# EAGLE schematic ledclock (EAGLE 7.3.0)
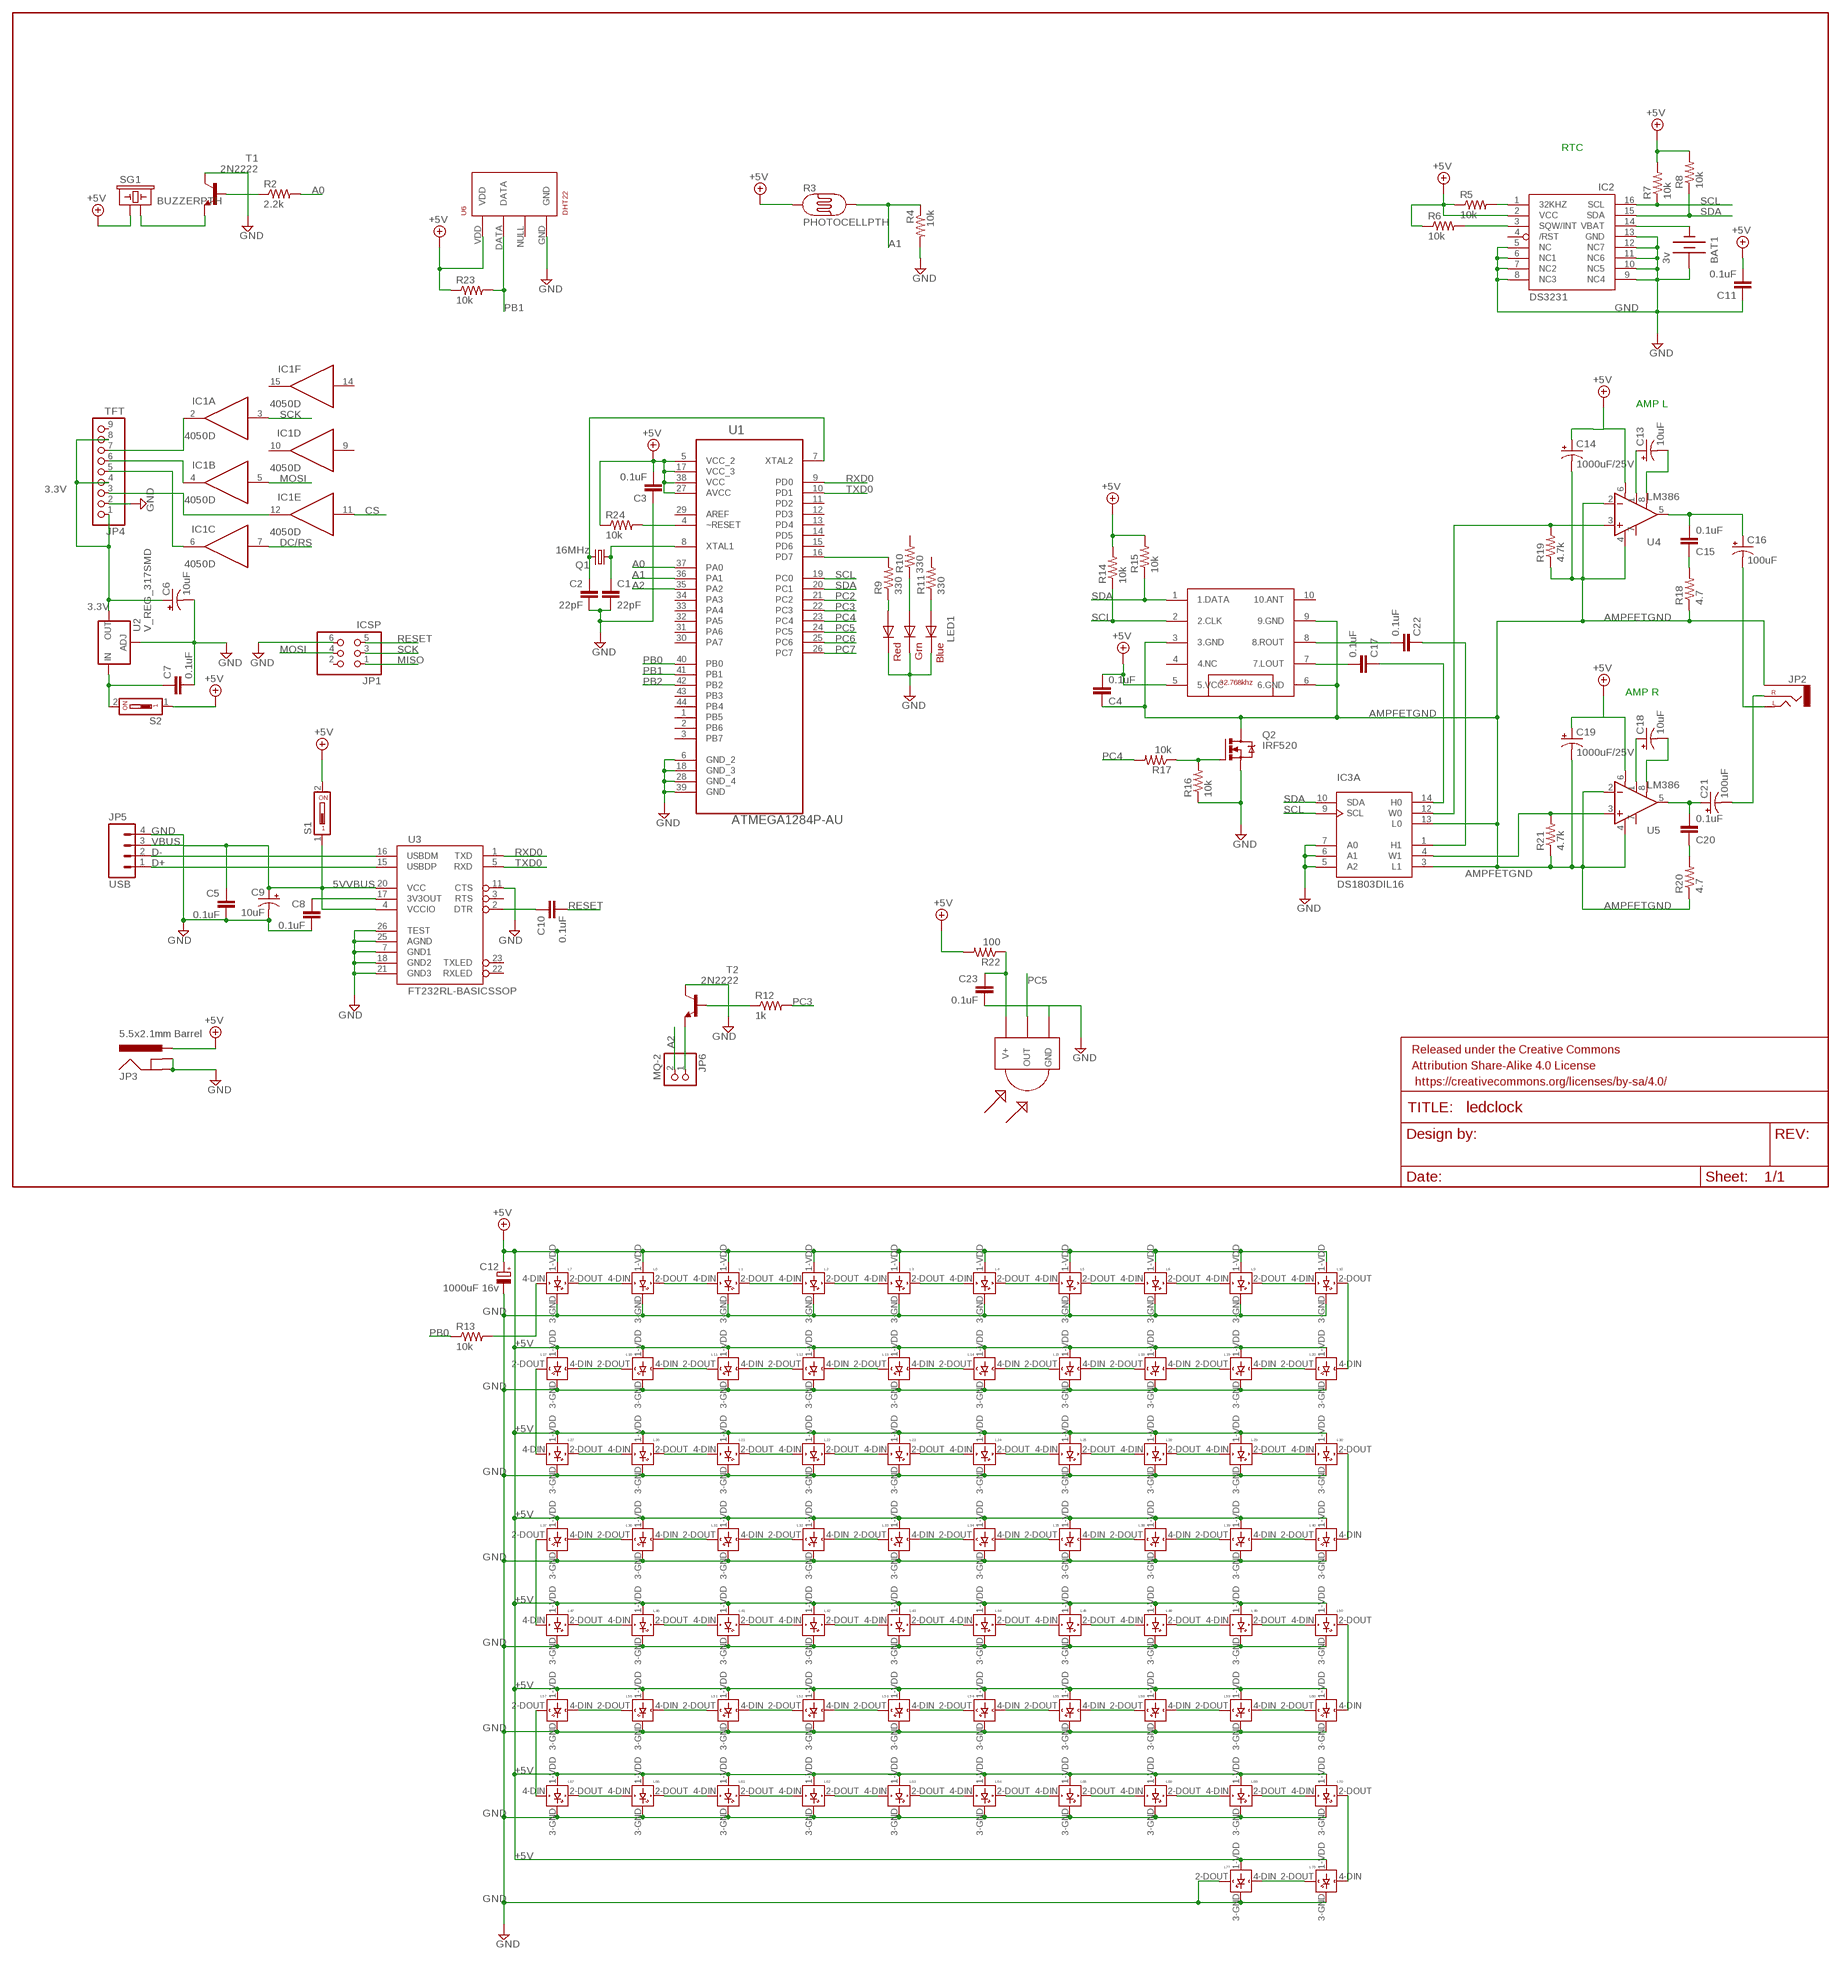
[diagram p0: schematic, sheet 1]

## Parts
BAT1  3v  BATTERY12MM  [BATTCON_12MM]
C1  22pF  22PF-50V-5%(0603)  [0603-CAP]
C2  22pF  22PF-50V-5%(0603)  [0603-CAP]
C3  0.1uF  0.1UF-16V(+-10%)(0402)  [0402-CAP]
C4  0.1uF  0.1UF-25V(+80/-20%)(0603)  [0603-CAP]
C5  0.1uF  0.1UF-25V(+80/-20%)(0603)  [0603-CAP]
C6  10uF  CAP_POL1206-KIT  [EIA3216-KIT]
C7  0.1uF  0.1UF-25V(+80/-20%)(0603)  [0603-CAP]
C8  0.1uF  0.1UF-25V(+80/-20%)(0603)  [0603-CAP]
C9  10uF  CAP_POLPTH2  [CPOL-RADIAL-10UF-25V]
C10  0.1uF  0.1UF-25V(+80/-20%)(0603)  [0603-CAP]
C11  0.1uF  0.1UF-25V(+80/-20%)(0603)  [0603-CAP]
C12  1000uF 16v  CPOL-EUE10-20  [EB20D]
C13  10uF  CAP_POL1206-KIT  [EIA3216-KIT]
C14  1000uF/25V  CAP_POLPTH4  [CPOL-RADIAL-1000UF-25V]
C15  0.1uF  0.1UF-25V(+80/-20%)(0603)  [0603-CAP]
C16  100uF  100UF-63V-20%(ELECT)  [NIC_10X10.5_CAP]
C17  0.1uF  0.1UF-25V(+80/-20%)(0603)  [0603-CAP]
C18  10uF  CAP_POL1206-KIT  [EIA3216-KIT]
C19  1000uF/25V  CAP_POLPTH4  [CPOL-RADIAL-1000UF-25V]
C20  0.1uF  0.1UF-25V(+80/-20%)(0603)  [0603-CAP]
C21  100uF  100UF-63V-20%(ELECT)  [NIC_10X10.5_CAP]
C22  0.1uF  0.1UF-25V(+80/-20%)(0603)  [0603-CAP]
C23  0.1uF  0.1UF-25V(+80/-20%)(0603)  [0603-CAP]
FRAME1  FRAME-LEDGER  [CREATIVE_COMMONS]
IC1  4050D  [SO16]
IC2  DS3231/SO  [SO16W]
IC3  DS1803DIL16  [DIL16]
JP1  ICSP  PINHD-2X3/90  [2X03/90]
JP2  AUDIO-JACK1:1  [STEREOJACK2.5MM]
JP3  5.5x2.1mm Barrel  POWER_JACKSMD  [POWER_JACK_SMD]
JP4  TFT  PINHD-1X9/90  [1X09/90]
JP5  USB  M04JST  [1X04-1.5MM_JST]
JP6  MQ-2  PINHD-1X2/90  [1X02/90]
L1  WS2812B  [WS2812B]
L2  WS2812B  [WS2812B]
L3  WS2812B  [WS2812B]
L4  WS2812B  [WS2812B]
L5  WS2812B  [WS2812B]
L6  WS2812B  [WS2812B]
L7  WS2812B  [WS2812B]
L8  WS2812B  [WS2812B]
L9  WS2812B  [WS2812B]
L10  WS2812B  [WS2812B]
L11  WS2812B  [WS2812B]
L12  WS2812B  [WS2812B]
L13  WS2812B  [WS2812B]
L14  WS2812B  [WS2812B]
L15  WS2812B  [WS2812B]
L16  WS2812B  [WS2812B]
L17  WS2812B  [WS2812B]
L18  WS2812B  [WS2812B]
L19  WS2812B  [WS2812B]
L20  WS2812B  [WS2812B]
L21  WS2812B  [WS2812B]
L22  WS2812B  [WS2812B]
L23  WS2812B  [WS2812B]
L24  WS2812B  [WS2812B]
L25  WS2812B  [WS2812B]
L26  WS2812B  [WS2812B]
L27  WS2812B  [WS2812B]
L28  WS2812B  [WS2812B]
L29  WS2812B  [WS2812B]
L30  WS2812B  [WS2812B]
L31  WS2812B  [WS2812B]
L32  WS2812B  [WS2812B]
L33  WS2812B  [WS2812B]
L34  WS2812B  [WS2812B]
L35  WS2812B  [WS2812B]
L36  WS2812B  [WS2812B]
L37  WS2812B  [WS2812B]
L38  WS2812B  [WS2812B]
L39  WS2812B  [WS2812B]
L40  WS2812B  [WS2812B]
L41  WS2812B  [WS2812B]
L42  WS2812B  [WS2812B]
L43  WS2812B  [WS2812B]
L44  WS2812B  [WS2812B]
L45  WS2812B  [WS2812B]
L46  WS2812B  [WS2812B]
L47  WS2812B  [WS2812B]
L48  WS2812B  [WS2812B]
L49  WS2812B  [WS2812B]
L50  WS2812B  [WS2812B]
L51  WS2812B  [WS2812B]
L52  WS2812B  [WS2812B]
L53  WS2812B  [WS2812B]
L54  WS2812B  [WS2812B]
L55  WS2812B  [WS2812B]
L56  WS2812B  [WS2812B]
L57  WS2812B  [WS2812B]
L58  WS2812B  [WS2812B]
L59  WS2812B  [WS2812B]
L60  WS2812B  [WS2812B]
L61  WS2812B  [WS2812B]
L62  WS2812B  [WS2812B]
L63  WS2812B  [WS2812B]
L64  WS2812B  [WS2812B]
L65  WS2812B  [WS2812B]
L66  WS2812B  [WS2812B]
L67  WS2812B  [WS2812B]
L68  WS2812B  [WS2812B]
L69  WS2812B  [WS2812B]
L70  WS2812B  [WS2812B]
L76  WS2812B  [WS2812B]
L77  WS2812B  [WS2812B]
LED1  RGBLED5050  [RGBLED5050]
Q1  16MHz  CRYSTALHC49S  [HC49/S]
Q2  IRF520  [TO220BV]
R2  2.2k  RESISTOR1206  [1206]
R3  PHOTOCELLPTH  [PHOTOCELL]
R4  10k  RESISTOR1206  [1206]
R5  10k  RESISTOR1206  [1206]
R6  10k  RESISTOR1206  [1206]
R7  10k  RESISTOR1206  [1206]
R8  10k  RESISTOR1206  [1206]
R9  330  RESISTOR1206  [1206]
R10  330  RESISTOR1206  [1206]
R11  330  RESISTOR1206  [1206]
R12  1k  RESISTOR1206  [1206]
R13  10k  RESISTOR1206  [1206]
R14  10k  RESISTOR1206  [1206]
R15  10k  RESISTOR1206  [1206]
R16  10k  RESISTOR1206  [1206]
R17  10k  RESISTOR1206  [1206]
R18  4.7  RESISTOR1206  [1206]
R19  4.7k  RESISTOR1206  [1206]
R20  4.7  RESISTOR1206  [1206]
R21  4.7k  RESISTOR1206  [1206]
R22  100  RESISTOR1206  [1206]
R23  10k  RESISTOR1206  [1206]
R24  10k  RESISTOR1206  [1206]
S1  DS01  [DS-01]
S2  DS01  [DS-01]
SG1  BUZZERPTH  [BUZZER-12MM]
T1  2N2222  [TO18]
T2  2N2222  [TO18]
U1  ATMEGA1284P-AU  [QFP80P1200X1200X120-44N]
U2  V_REG_317SMD  [SOT223]
U3  FT232RL-BASICSSOP  [SSOP28DB]
U4  LM386  [DIP08]
U5  LM386  [DIP08]
U6  DHT22  RHT03_DHT-22_AM2302  [RHT03_DHT-22]
U$1  TEA5767  [TJ-102BC]
U$2  TSOP4838  [TSOP18XX]

## Nets
3.3V: C6.A(+) JP4.1 JP4.4 JP4.8 U2.2(OUT)
5VVBUS: C5.1 C9.1(+) S1.1 U3.4(VCCIO) U3.20(VCC)
+5V: C3.2 C4.2 C11.2 C12.+ C14.+ C19.+ IC2.2(VCC) JP3.VIN0(PWR) L1.1-VDD(VDD) L2.1-VDD(VDD) L3.1-VDD(VDD) L4.1-VDD(VDD) L5.1-VDD(VDD) L6.1-VDD(VDD) L7.1-VDD(VDD) L8.1-VDD(VDD) L9.1-VDD(VDD) L10.1-VDD(VDD) L11.1-VDD(VDD) L12.1-VDD(VDD) L13.1-VDD(VDD) L14.1-VDD(VDD) L15.1-VDD(VDD) L16.1-VDD(VDD) L17.1-VDD(VDD) L18.1-VDD(VDD) L19.1-VDD(VDD) L20.1-VDD(VDD) L21.1-VDD(VDD) L22.1-VDD(VDD) L23.1-VDD(VDD) L24.1-VDD(VDD) L25.1-VDD(VDD) L26.1-VDD(VDD) L27.1-VDD(VDD) L28.1-VDD(VDD) L29.1-VDD(VDD) L30.1-VDD(VDD) L31.1-VDD(VDD) L32.1-VDD(VDD) L33.1-VDD(VDD) L34.1-VDD(VDD) L35.1-VDD(VDD) L36.1-VDD(VDD) L37.1-VDD(VDD) L38.1-VDD(VDD) L39.1-VDD(VDD) L40.1-VDD(VDD) L41.1-VDD(VDD) L42.1-VDD(VDD) L43.1-VDD(VDD) L44.1-VDD(VDD) L45.1-VDD(VDD) L46.1-VDD(VDD) L47.1-VDD(VDD) L48.1-VDD(VDD) L49.1-VDD(VDD) L50.1-VDD(VDD) L51.1-VDD(VDD) L52.1-VDD(VDD) L53.1-VDD(VDD) L54.1-VDD(VDD) L55.1-VDD(VDD) L56.1-VDD(VDD) L57.1-VDD(VDD) L58.1-VDD(VDD) L59.1-VDD(VDD) L60.1-VDD(VDD) L61.1-VDD(VDD) L62.1-VDD(VDD) L63.1-VDD(VDD) L64.1-VDD(VDD) L65.1-VDD(VDD) L66.1-VDD(VDD) L67.1-VDD(VDD) L68.1-VDD(VDD) L69.1-VDD(VDD) L70.1-VDD(VDD) L76.1-VDD(VDD) L77.1-VDD(VDD) R3.1 R5.1 R6.1 R7.2 R8.2 R14.2 R15.2 R22.2 R23.1 R24.1 S1.2 S2.1 SG1.+ U1.5(VCC_2) U1.17(VCC_3) U1.27(AVCC) U1.38(VCC) U4.6(V+) U5.6(V+) U6.VDD U$1.5(5.VCC)
A0: R2.2 U1.37(PA0)
A1: R3.2 R4.1 U1.36(PA1)
A2: JP6.2 U1.35(PA2)
AMPFETGND: C4.1 C14.- C19.- IC3.3(A:L1) IC3.13(A:L0) JP2.5(SLEEVE) Q2.D R18.1 R19.1 R20.1 R21.1 U4.2(-IN) U4.4(V-) U5.2(-IN) U5.4(V-) U$1.3(3.GND) U$1.6(6.GND) U$1.9(9.GND)
CS: IC1.11(E:I)
D+: JP5.1 U3.15(USBDP)
D-: JP5.2 U3.16(USBDM)
DC/RS: IC1.7(C:I)
GND: BAT1.PWR@1(+) C1.2 C2.2 C3.1 C5.2 C6.C(-) C7.2 C8.2 C9.2(-) C11.1 C12.- C23.2 IC2.5(NC) IC2.6(NC1) IC2.7(NC2) IC2.8(NC3) IC2.13(GND) IC3.5(A:A2) IC3.6(A:A1) IC3.7(A:A0) JP1.6 JP3.GND(GNDBREAK) JP3.P$4(GND) JP4.2 JP5.4 L1.3-GND(GND) L2.3-GND(GND) L3.3-GND(GND) L4.3-GND(GND) L5.3-GND(GND) L6.3-GND(GND) L7.3-GND(GND) L8.3-GND(GND) L9.3-GND(GND) L10.3-GND(GND) L11.3-GND(GND) L12.3-GND(GND) L13.3-GND(GND) L14.3-GND(GND) L15.3-GND(GND) L16.3-GND(GND) L17.3-GND(GND) L18.3-GND(GND) L19.3-GND(GND) L20.3-GND(GND) L21.3-GND(GND) L22.3-GND(GND) L23.3-GND(GND) L24.3-GND(GND) L25.3-GND(GND) L26.3-GND(GND) L27.3-GND(GND) L28.3-GND(GND) L29.3-GND(GND) L30.3-GND(GND) L31.3-GND(GND) L32.3-GND(GND) L33.3-GND(GND) L34.3-GND(GND) L35.3-GND(GND) L36.3-GND(GND) L37.3-GND(GND) L38.3-GND(GND) L39.3-GND(GND) L40.3-GND(GND) L41.3-GND(GND) L42.3-GND(GND) L43.3-GND(GND) L44.3-GND(GND) L45.3-GND(GND) L46.3-GND(GND) L47.3-GND(GND) L48.3-GND(GND) L49.3-GND(GND) L50.3-GND(GND) L51.3-GND(GND) L52.3-GND(GND) L53.3-GND(GND) L54.3-GND(GND) L55.3-GND(GND) L56.3-GND(GND) L57.3-GND(GND) L58.3-GND(GND) L59.3-GND(GND) L60.3-GND(GND) L61.3-GND(GND) L62.3-GND(GND) L63.3-GND(GND) L64.3-GND(GND) L65.3-GND(GND) L66.3-GND(GND) L67.3-GND(GND) L68.3-GND(GND) L69.3-GND(GND) L70.3-GND(GND) L76.3-GND(GND) L77.2-DOUT(DOUT) L77.3-GND(GND) LED1.4(BLUE_C) LED1.5(RED_C) LED1.6(GREEN_C) Q2.S R4.2 R16.1 T1.3(C) T2.3(C) U1.6(GND_2) U1.18(GND_3) U1.28(GND_4) U1.39(GND) U2.1(ADJ) U3.7(GND1) U3.11(CTS) U3.18(GND2) U3.21(GND3) U3.25(AGND) U3.26(TEST) U6.GND U$2.GND
MISO: JP1.1
MOSI: IC1.5(B:I) JP1.4
N$1: BAT1.GND(-)
N$2: IC2.1(32KHZ) R5.2
N$3: IC2.3(SQW/INT) R6.2
N$4: C10.1 U3.2(DTR)
N$5: C7.1 S2.2 U2.3(IN)
N$6: IC1.2(A:O) JP4.7
N$7: IC1.4(B:O) JP4.6
N$8: IC1.6(C:O) JP4.5
N$9: IC1.12(E:O) JP4.3
N$10: R9.2 U1.16(PD7)
N$11: SG1.-
N$12: C8.1 U3.17(3V3OUT)
N$13: R2.1 T1.2(B)
N$14: T1.1(E)
N$15: LED1.2(RED_A) R9.1
N$16: LED1.1(GREEN_A) R10.1
N$17: LED1.3(BLUE_A) R11.1
N$18: JP6.1 T2.1(E)
N$19: L10.2-DOUT(DOUT) L20.4-DIN(DIN)
N$20: R12.1 T2.2(B)
N$21: L6.4-DIN(DIN) L7.2-DOUT(DOUT)
N$22: L1.4-DIN(DIN) L6.2-DOUT(DOUT)
N$23: L1.2-DOUT(DOUT) L2.4-DIN(DIN)
N$24: L2.2-DOUT(DOUT) L3.4-DIN(DIN)
N$25: L3.2-DOUT(DOUT) L4.4-DIN(DIN)
N$26: L4.2-DOUT(DOUT) L5.4-DIN(DIN)
N$27: L5.2-DOUT(DOUT) L8.4-DIN(DIN)
N$28: L8.2-DOUT(DOUT) L9.4-DIN(DIN)
N$29: L9.2-DOUT(DOUT) L10.4-DIN(DIN)
N$30: L19.4-DIN(DIN) L20.2-DOUT(DOUT)
N$31: L18.4-DIN(DIN) L19.2-DOUT(DOUT)
N$32: L15.4-DIN(DIN) L18.2-DOUT(DOUT)
N$33: L14.4-DIN(DIN) L15.2-DOUT(DOUT)
N$34: L13.4-DIN(DIN) L14.2-DOUT(DOUT)
N$35: L12.4-DIN(DIN) L13.2-DOUT(DOUT)
N$36: L11.4-DIN(DIN) L12.2-DOUT(DOUT)
N$37: L11.2-DOUT(DOUT) L16.4-DIN(DIN)
N$38: L16.2-DOUT(DOUT) L17.4-DIN(DIN)
N$39: L17.2-DOUT(DOUT) L27.4-DIN(DIN)
N$40: L26.4-DIN(DIN) L27.2-DOUT(DOUT)
N$41: L21.4-DIN(DIN) L26.2-DOUT(DOUT)
N$42: L21.2-DOUT(DOUT) L22.4-DIN(DIN)
N$43: L22.2-DOUT(DOUT) L23.4-DIN(DIN)
N$44: L23.2-DOUT(DOUT) L24.4-DIN(DIN)
N$45: L24.2-DOUT(DOUT) L25.4-DIN(DIN)
N$46: L25.2-DOUT(DOUT) L28.4-DIN(DIN)
N$47: L28.2-DOUT(DOUT) L29.4-DIN(DIN)
N$48: L29.2-DOUT(DOUT) L30.4-DIN(DIN)
N$49: L30.2-DOUT(DOUT) L40.4-DIN(DIN)
N$50: L39.4-DIN(DIN) L40.2-DOUT(DOUT)
N$51: L38.4-DIN(DIN) L39.2-DOUT(DOUT)
N$52: L35.4-DIN(DIN) L38.2-DOUT(DOUT)
N$53: L34.4-DIN(DIN) L35.2-DOUT(DOUT)
N$54: L33.4-DIN(DIN) L34.2-DOUT(DOUT)
N$55: L32.4-DIN(DIN) L33.2-DOUT(DOUT)
N$56: L31.4-DIN(DIN) L32.2-DOUT(DOUT)
N$57: L31.2-DOUT(DOUT) L36.4-DIN(DIN)
N$58: L36.2-DOUT(DOUT) L37.4-DIN(DIN)
N$59: L37.2-DOUT(DOUT) L47.4-DIN(DIN)
N$60: L46.4-DIN(DIN) L47.2-DOUT(DOUT)
N$61: L41.4-DIN(DIN) L46.2-DOUT(DOUT)
N$62: L41.2-DOUT(DOUT) L42.4-DIN(DIN)
N$63: L42.2-DOUT(DOUT) L43.4-DIN(DIN)
N$64: L43.2-DOUT(DOUT) L44.4-DIN(DIN)
N$65: L44.2-DOUT(DOUT) L45.4-DIN(DIN)
N$66: L45.2-DOUT(DOUT) L48.4-DIN(DIN)
N$67: L48.2-DOUT(DOUT) L49.4-DIN(DIN)
N$68: L49.2-DOUT(DOUT) L50.4-DIN(DIN)
N$69: L50.2-DOUT(DOUT) L60.4-DIN(DIN)
N$70: L59.4-DIN(DIN) L60.2-DOUT(DOUT)
N$71: L58.4-DIN(DIN) L59.2-DOUT(DOUT)
N$72: L55.4-DIN(DIN) L58.2-DOUT(DOUT)
N$73: L54.4-DIN(DIN) L55.2-DOUT(DOUT)
N$74: L53.4-DIN(DIN) L54.2-DOUT(DOUT)
N$75: L52.4-DIN(DIN) L53.2-DOUT(DOUT)
N$76: L51.4-DIN(DIN) L52.2-DOUT(DOUT)
N$77: L51.2-DOUT(DOUT) L56.4-DIN(DIN)
N$78: L56.2-DOUT(DOUT) L57.4-DIN(DIN)
N$79: L57.2-DOUT(DOUT) L67.4-DIN(DIN)
N$80: L66.4-DIN(DIN) L67.2-DOUT(DOUT)
N$81: L61.4-DIN(DIN) L66.2-DOUT(DOUT)
N$82: L61.2-DOUT(DOUT) L62.4-DIN(DIN)
N$83: L62.2-DOUT(DOUT) L63.4-DIN(DIN)
N$84: L63.2-DOUT(DOUT) L64.4-DIN(DIN)
N$85: L64.2-DOUT(DOUT) L65.4-DIN(DIN)
N$86: L65.2-DOUT(DOUT) L68.4-DIN(DIN)
N$87: L68.2-DOUT(DOUT) L69.4-DIN(DIN)
N$88: L69.2-DOUT(DOUT) L70.4-DIN(DIN)
N$89: L70.2-DOUT(DOUT) L76.4-DIN(DIN)
N$90: L76.2-DOUT(DOUT) L77.4-DIN(DIN)
N$91: L7.4-DIN(DIN) R13.2
N$92: Q2.G R16.2 R17.1
N$93: C17.1 IC3.14(A:H0)
N$94: C13.A(+) U4.1(GAIN)
N$95: C13.C(-) U4.8(GAIN)
N$96: C16.- JP2.1(LEFT)
N$97: C17.2 U$1.7(7.LOUT)
N$98: C21.- JP2.4(RIGHT)
N$99: IC3.12(A:W0) R19.2 U4.3(+IN)
N$100: C15.2 C16.+ U4.5(OUT)
N$101: C15.1 R18.2
N$102: C22.1 IC3.1(A:H1)
N$103: C18.A(+) U5.1(GAIN)
N$104: C18.C(-) U5.8(GAIN)
N$105: C20.2 C21.+ U5.5(OUT)
N$106: C20.1 R20.2
N$107: C22.2 U$1.8(8.ROUT)
N$108: C23.1 R22.1 U$2.VCC(V+)
N$109: IC3.4(A:W1) R21.2 U5.3(+IN)
PB0: R13.1 U1.40(PB0)
PB1: R23.2 U1.41(PB1) U6.DATA
PB2: U1.42(PB2)
PC2: U1.21(PC2)
PC3: R12.2 U1.22(PC3)
PC4: R17.2 U1.23(PC4)
PC5: U1.24(PC5) U$2.OUT
PC6: U1.25(PC6)
PC7: U1.26(PC7)
RESET: C10.2 JP1.5 R24.2 U1.4(~RESET)
RXD0: U1.9(PD0) U3.1(TXD)
SCK: IC1.3(A:I) JP1.3
SCL: IC2.16(SCL) IC3.9(A:SCL) R7.1 R14.1 U1.19(PC0) U$1.2(2.CLK)
SDA: IC2.15(SDA) IC3.10(A:SDA) R8.1 R15.1 U1.20(PC1) U$1.1(1.DATA)
TXD0: U1.10(PD1) U3.5(RXD)
VBUS: JP5.3
XLAT1: C1.1 Q1.1 U1.8(XTAL1)
XLAT2: C2.1 Q1.2 U1.7(XTAL2)
Unconnected: IC1.9(D:I) IC1.10(D:O) IC1.14(F:I) IC1.15(F:O) IC2.4(/RST) IC2.9(NC4) IC2.10(NC5) IC2.11(NC6) IC2.12(NC7) JP1.2 JP4.9 R10.2 R11.2 U1.1(PB5) U1.2(PB6) U1.3(PB7) U1.11(PD2) U1.12(PD3) U1.13(PD4) U1.14(PD5) U1.15(PD6) U1.29(AREF) U1.30(PA7) U1.31(PA6) U1.32(PA5) U1.33(PA4) U1.34(PA3) U1.43(PB3) U1.44(PB4) U3.3(RTS) U3.22(RXLED) U3.23(TXLED) U4.7(BP) U5.7(BP) U6.NULL U$1.4(4.NC) U$1.10(10.ANT)

## Notes on the sheet
- RTC
- AMP L
- AMP R

## Power pins joined to a net without a drawn wire
GND: IC3.8(P:GND)
VBAT: IC2.14(VBAT)
VCC: IC3.16(P:VCC)
VDD: IC1.1(P:VDD)
VSS: IC1.8(P:VSS)

## Library data of the parts
BAT1 = SparkFun-Electromechanical:BATTERY: Battery Holders Various common sizes : AA, AAA, 18650 (PRT-12895), 20mm coin cell and 12mm coin cell. 20MM_4LEGS, BATT-10373; PROD_ID: BATT-08044
C1 C2 = SparkFun-Capacitors:22PF-50V-5%(0603): CAP-07876; PROD_ID: CAP-07876
C3 = SparkFun-Capacitors:0.1UF-16V(+-10%)(0402); PROD_ID: CAP-12416
C4 C5 C7 C8 C10 C11 C15 C17 C20 C22 C23 = SparkFun-Capacitors:0.1UF-25V(+80/-20%)(0603): CAP-00810 Ceramic Standard decoupling cap; PROD_ID: CAP-00810
C6 C9 C13 C14 C18 C19 = SparkFun-Capacitors:CAP_POL: Capacitor Polarized These are standard SMD and PTH capacitors. Normally 10uF, 47uF, and 100uF in electrolytic and tantalum varieties. Always verify the external diameter of the through hole cap, it varies with capacity, voltage, and manufacturer. The EIA devices should be standard.
C12 = resistor:CPOL-EU: POLARIZED CAPACITOR, European symbol
C16 C21 = SparkFun-Capacitors:100UF-63V-20%(ELECT): CAP-08362 100uF electrolytic SMT 63V 20%; PROD_ID: CAP-08362
FRAME1 = SparkFun-Aesthetics:FRAME-LEDGER: Schematic Frame Standard 11x14 US Ledger frame
IC1 = 40xx:4050: Hex non-inverting BUFFER
IC2 = adafruit:DS3231
IC3 = ds1803:DS1803?: Addresable Dual Digital Potentiometer
JP1 = pinhead:PINHD-2X3: PIN HEADER
JP2 = SparkFun-Connectors:AUDIO-JACK: 3.5mm Audio Jack Simple 3.5mm common PCB mount audio jack. Variant PTH is our storefront SKU PRT-08032
JP3 = SparkFun-Connectors:POWER_JACK: Power Jack This is the standard 5.5mm barrel jack for power. The PTH is the most common, proven, reliable, footprint. The Slot footprint only works if the mill layer is transmitted to the PCB fab house so be warned. Mating wall wart : TOL-00298 (and others); PROD_ID: CONN-08106; SF_ID: PRT-12748
JP4 = pinhead:PINHD-1X9: PIN HEADER
JP5 = SparkFun-Connectors:M04: Header 4 Standard 4-pin 0.1" header. Use with straight break away headers (SKU : PRT-00116), right angle break away headers (PRT-00553), swiss pins (PRT-00743), machine pins (PRT-00117), and female headers (PRT-00115). Molex polarized connector foot print use with SKU : PRT-08231 with associated crimp pins and housings. 1MM SMD Version SKU: PRT-10208
JP6 = pinhead:PINHD-1X2: PIN HEADER
L1-L70 L76 L77 = adafruit:WS2812B
LED1 = adafruit:RGBLED: For 5050 RGB LEDs, the order of the LEDs may vary from one manufacturer to another!
Q1 = crystal:CRYSTAL: CRYSTAL; OC_FARNELL: 1667008; OC_NEWARK: unknown
Q2 = transistor-power:IRF520: HEXFET Power MOSFET
R2 R4-R24 = SparkFun-Passives:RESISTOR: Resistor Basic schematic elements and footprints for 0603, 1206, and PTH resistors.
R3 = SparkFun-Sensors:PHOTOCELL: CdS photoresistor. This is a low cost way to detect light levels. Resistance decreases with more incoming light. SparkFun SKU: SEN-09088
S1 S2 = switch-dil:DS01: DIL/CODE SWITCH; OC_FARNELL: unknown; OC_NEWARK: unknown
SG1 = SparkFun-Electromechanical:BUZZER: Buzzer 12mm Spark Fun Electronics SKU : Comp-Buzzer
T1 T2 = transistor:2N2222: NPN TRANSISTOR
U1 = Atmel_By_element14_Batch_1-00:ATMEGA1284P-AU: Microcontroller with Programmable Flash; MPN: ATMEGA1284P-AU; OC_FARNELL: 1715480; OC_NEWARK: 15R0263; PACKAGE: TQFP-44; SUPPLIER: Atmel
U2 = SparkFun-PowerIC:V_REG_317: Voltage Regulator Standard LM317 adjustable voltage regulator. AOI (Adjust Output Input). Google 'LM317 Calculator' for easy to use app to get the two resistor values needed. 240/720 for 5V output. 240/390 for 3.3V output. Spark Fun Electronics SKU : COM-00527
U3 = SparkFun-DigitalIC:FT232RL-BASIC: USB UART This is the simplified version of the FT232RL unit. Only what you need, nothing you don't. Spark Fun Electronics SKU : COM-00650
U4 U5 = SparkFun-AnalogIC:LM386: low voltage audio power amplifier
U6 = RHT03_DHT-22_AM2302:RHT03_DHT-22_AM2302: RHT03 / DHT-22 / AM2302 Packages and symbol for the RHT03 / DHT-22 relative humidity and temperature sensor. Note: The AM2302 is a wired version of the DHT-22 which typically requires less clearance and is thus provided as a separate package.; PROD_ID: SEN-10167
U$1 = TEA5767:TEA5767
U$2 = tsop:TSOP4838: IR Receiver and Demodulator